# EAGLE design TinkerKit-board (EAGLE 7.5.0)
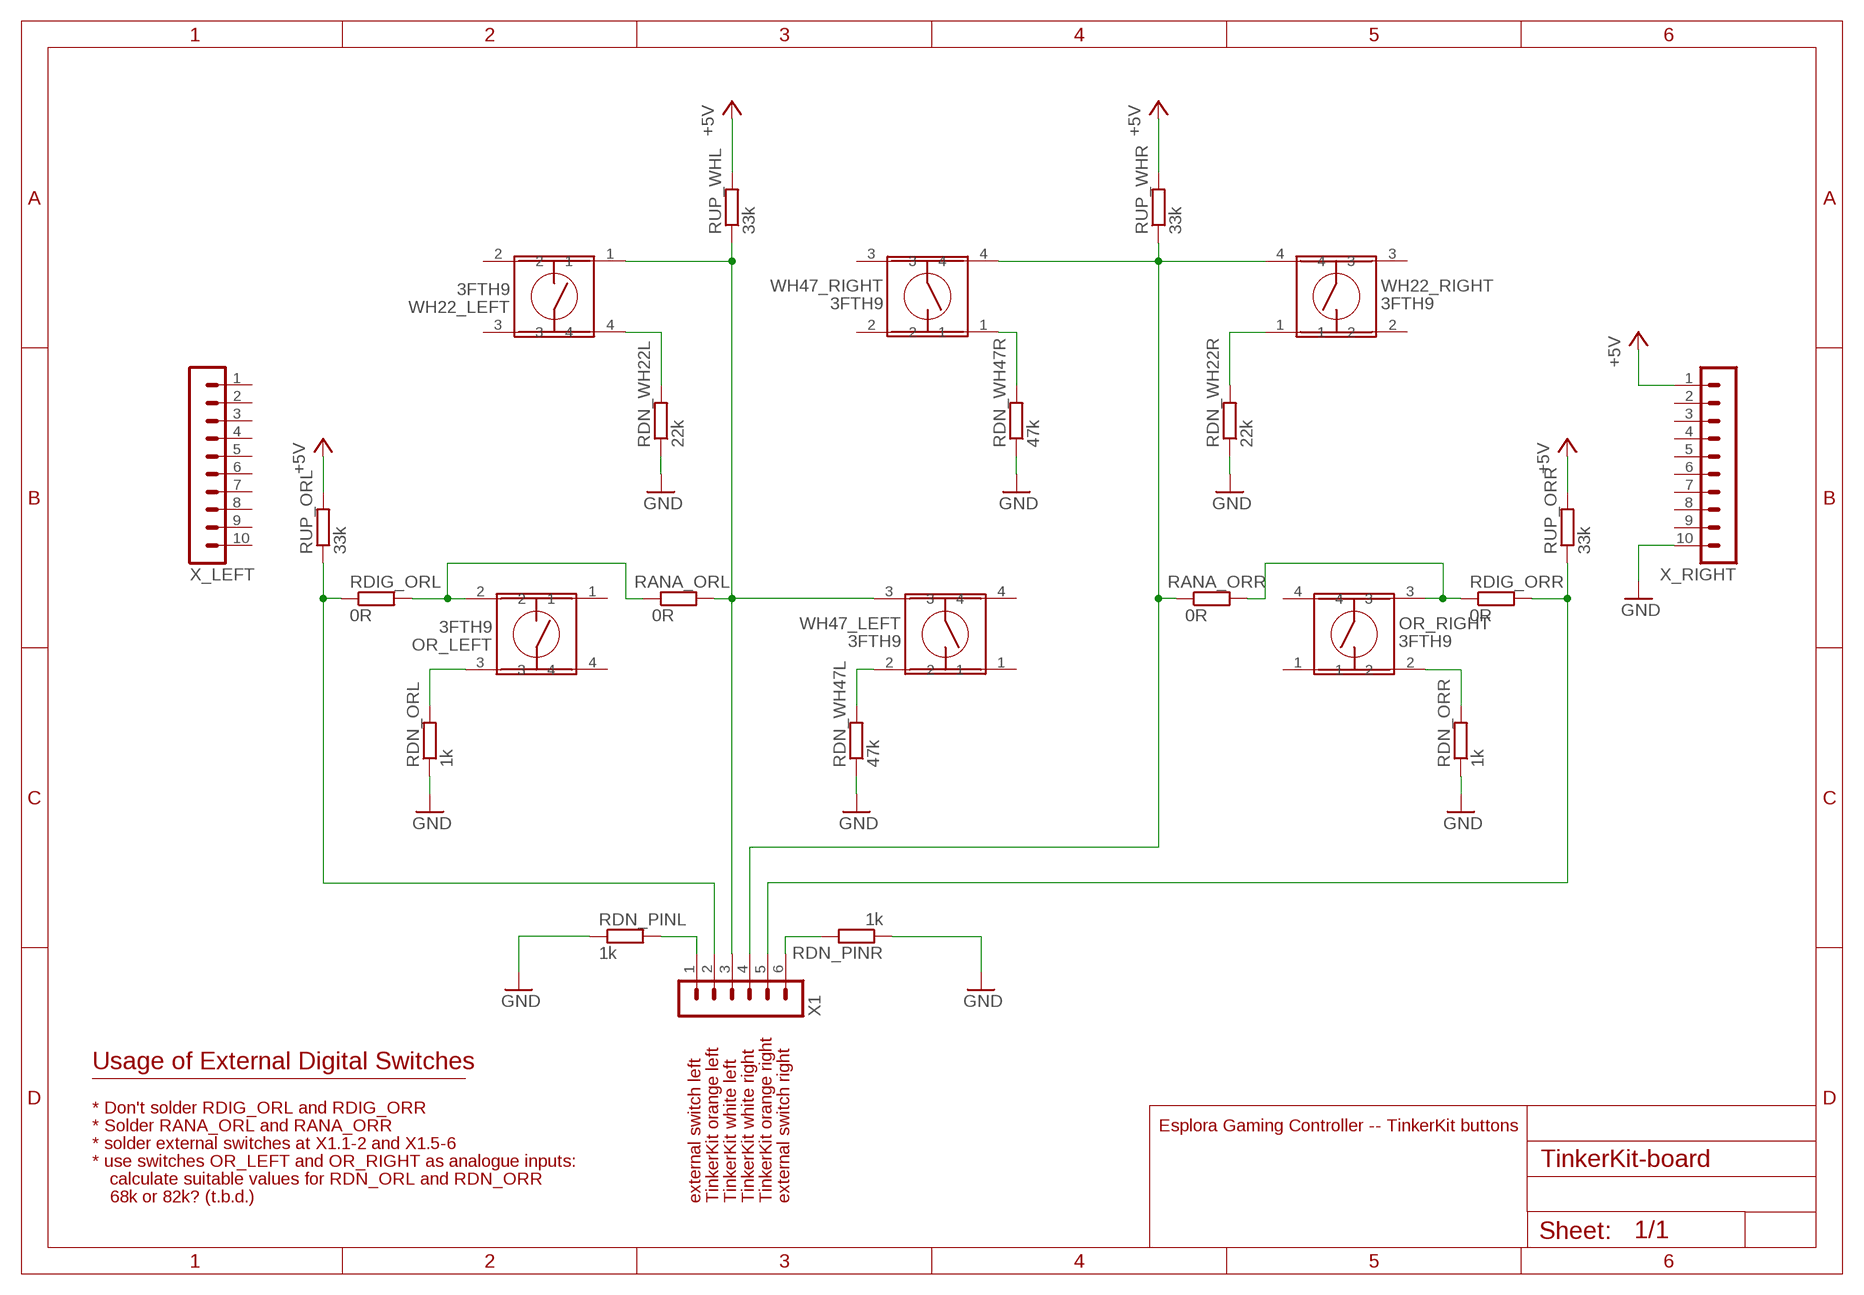
[diagram p0: schematic, sheet 1]

## Parts
OR_LEFT  3FTH9  [3FTH9]
OR_RIGHT  3FTH9  [3FTH9]
RANA_ORL  0R  R-EU_R0603  [R0603]
RANA_ORR  0R  R-EU_R0603  [R0603]
RDIG_ORL  0R  R-EU_R0603  [R0603]
RDIG_ORR  0R  R-EU_R0603  [R0603]
RDN_ORL  1k  R-EU_M1206  [M1206]
RDN_ORR  1k  R-EU_M1206  [M1206]
RDN_PINL  1k  R-EU_R0603  [R0603]
RDN_PINR  1k  R-EU_R0603  [R0603]
RDN_WH22L  22k  R-EU_M1206  [M1206]
RDN_WH22R  22k  R-EU_M1206  [M1206]
RDN_WH47L  47k  R-EU_M1206  [M1206]
RDN_WH47R  47k  R-EU_M1206  [M1206]
RUP_ORL  33k  R-EU_M1206  [M1206]
RUP_ORR  33k  R-EU_M1206  [M1206]
RUP_WHL  33k  R-EU_M1206  [M1206]
RUP_WHR  33k  R-EU_M1206  [M1206]
WH22_LEFT  3FTH9  [3FTH9]
WH22_RIGHT  3FTH9  [3FTH9]
WH47_LEFT  3FTH9  [3FTH9]
WH47_RIGHT  3FTH9  [3FTH9]
X1  MA06-1  [MA06-1]
X_LEFT  MA10-1  [MA10-1]
X_RIGHT  MA10-1  [MA10-1]

## Nets
+5V: RUP_ORL.2 RUP_ORR.2 RUP_WHL.2 RUP_WHR.2 X_RIGHT.1
GND: RDN_ORL.1 RDN_ORR.1 RDN_PINL.1 RDN_PINR.1 RDN_WH22L.1 RDN_WH22R.1 RDN_WH47L.1 RDN_WH47R.1 X_RIGHT.10
N$1: OR_LEFT.3 RDN_ORL.2
N$3: OR_RIGHT.2 RDN_ORR.2
N$6: RDN_WH22L.2 WH22_LEFT.4
N$7: RDN_WH47L.2 WH47_LEFT.2
N$8: RDN_WH22R.2 WH22_RIGHT.1
N$9: RDN_WH47R.2 WH47_RIGHT.1
N$15: OR_LEFT.2 RANA_ORL.1 RDIG_ORL.2
N$16: OR_RIGHT.3 RANA_ORR.2 RDIG_ORR.1
ORANGE_LEFT: RDIG_ORL.1 RUP_ORL.1 X1.2
ORANGE_RIGHT: RDIG_ORR.2 RUP_ORR.1 X1.5
PIN_LEFT: RDN_PINL.2 X1.1
PIN_RIGHT: RDN_PINR.2 X1.6
WHITE_LEFT: RANA_ORL.2 RUP_WHL.1 WH22_LEFT.1 WH47_LEFT.3 X1.3
WHITE_RIGHT: RANA_ORR.1 RUP_WHR.1 WH22_RIGHT.4 WH47_RIGHT.4 X1.4
Unconnected: OR_LEFT.1 OR_LEFT.4 OR_RIGHT.1 OR_RIGHT.4 WH22_LEFT.2 WH22_LEFT.3 WH22_RIGHT.2 WH22_RIGHT.3 WH47_LEFT.1 WH47_LEFT.4 WH47_RIGHT.2 WH47_RIGHT.3 X_LEFT.1 X_LEFT.2 X_LEFT.3 X_LEFT.4 X_LEFT.5 X_LEFT.6 X_LEFT.7 X_LEFT.8 X_LEFT.9 X_LEFT.10 X_RIGHT.2 X_RIGHT.3 X_RIGHT.4 X_RIGHT.5 X_RIGHT.6 X_RIGHT.7 X_RIGHT.8 X_RIGHT.9

## Notes on the sheet
- Usage of External Digital Switches
- * Don't solder RDIG_ORL and RDIG_ORR
- * Solder RANA_ORL and RANA_ORR | Esplora Gaming Controller -- TinkerKit buttons
- * solder external switches at X1.1-2 and X1.5-6
- * use switches OR_LEFT and OR_RIGHT as analogue inputs:
- calculate suitable values for RDN_ORL and RDN_ORR
- 68k or 82k? (t.b.d.) | external switch left | TinkerKit orange left | TinkerKit white left | TinkerKit white right | TinkerKit orange right | external switch right

## Library data of the parts
OR_LEFT OR_RIGHT WH22_LEFT WH22_RIGHT WH47_LEFT WH47_RIGHT = EsploraGamingController:3FTH9: Multimec 3 series switches 3FTH9
RANA_ORL RANA_ORR RDIG_ORL RDIG_ORR RDN_ORL RDN_ORR RDN_PINL RDN_PINR RDN_WH22L RDN_WH22R RDN_WH47L RDN_WH47R RUP_ORL RUP_ORR RUP_WHL RUP_WHR = rcl:R-EU_: RESISTOR, European symbol
X1 = con-lstb:MA06-1: PIN HEADER; OC_FARNELL: unknown; OC_NEWARK: unknown
X_LEFT X_RIGHT = con-lstb:MA10-1: PIN HEADER; OC_FARNELL: unknown; OC_NEWARK: unknown

## Board
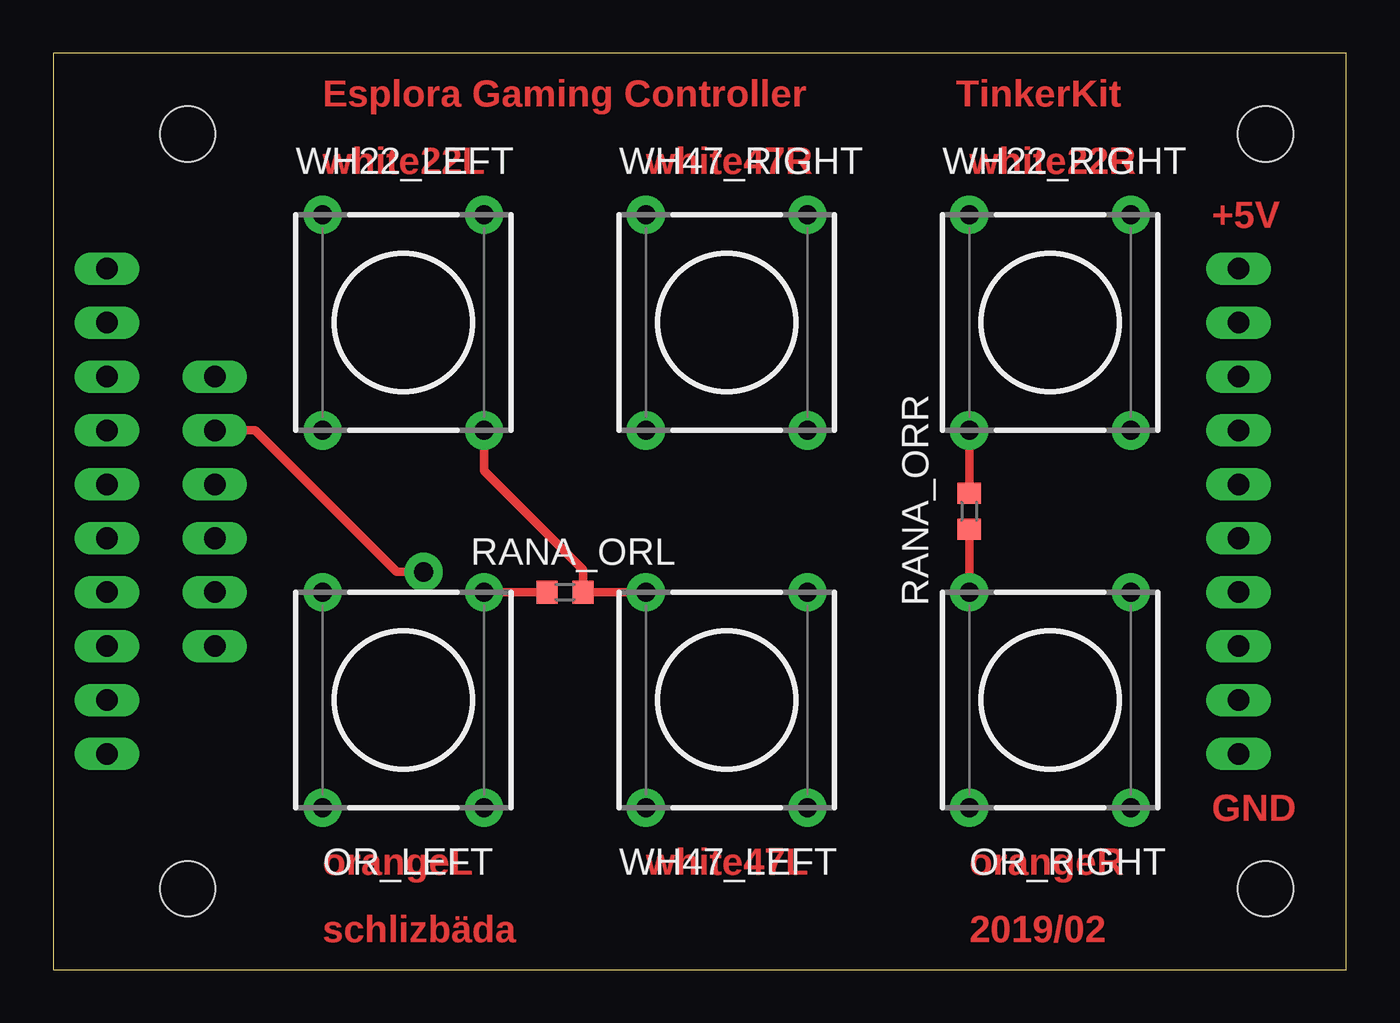
[diagram p1: board, top side]
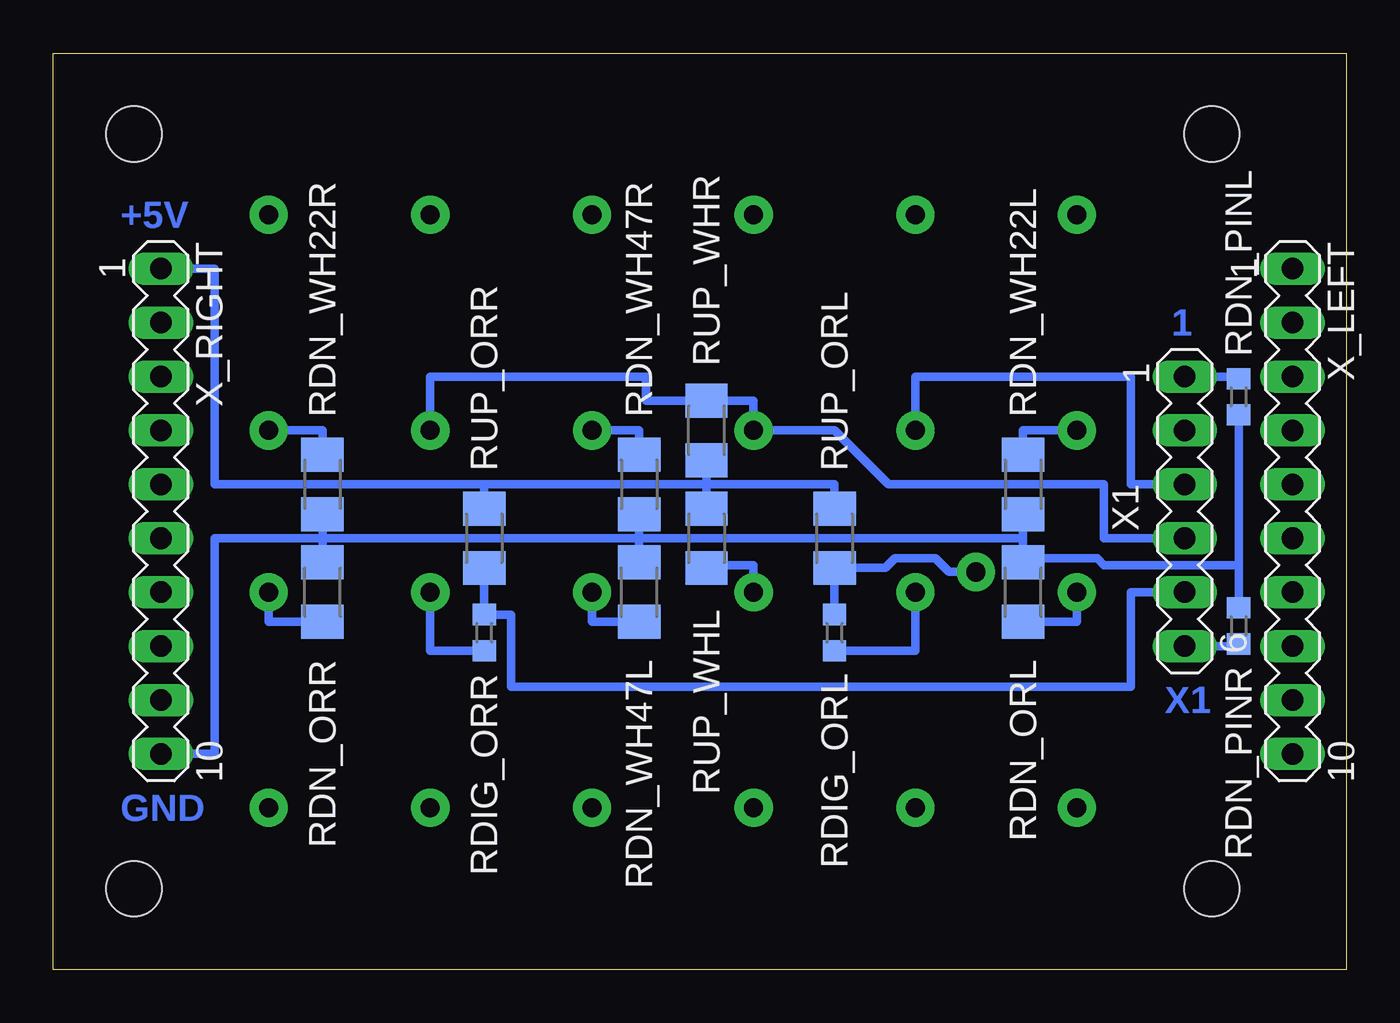
[diagram p2: board, bottom side, seen from below]

Size 60.96 x 43.18 mm. Coordinates in mm from the lower left corner, seen from the top.
Outline: 0,0 60.96,0 60.96,43.18 0,43.18 0,0
Copper layers (1*16): Top 0.035mm / dielectric 1.5mm / Bottom 0.035mm
Design rules "default": minimum track width 10mil, minimum drill 24mil, track to track 8mil, track to pad 8mil, pad to pad 8mil, via to via 8mil, smd to smd 8mil, copper to edge 40mil, drill to drill 8mil, minimum pad ring 10mil, minimum via ring 8mil, stop-mask expansion 4mil, vias tented up to drill 0mil, thermal gap 10mil
Holes 2.6 mm at 6.35,3.81 57.15,3.81 57.15,39.37 6.35,39.37

### Footprints (pad centres in the part's own frame; a part is rotated, then mirrored left to right if it is on the bottom)
3FTH9 = drill 0.9 pad 1.8: 1 -5.08,-2.54; 2 5.08,-2.54; 3 5.08,5.08; 4 -5.08,5.08
R0603 = smd 1 x 1.1: 1 -0.85,0; 2 0.85,0
M1206 = smd 1.6 x 2: 1 -1.4,0; 2 1.4,0
MA06-1 = drill 1.016 long: 1 -6.35,0; 2 -3.81,0; 3 -1.27,0; 4 1.27,0; 5 3.81,0; 6 6.35,0
MA10-1 = drill 1.016 long: 1 -11.43,0; 2 -8.89,0; 3 -6.35,0; 4 -3.81,0; 5 -1.27,0; 6 1.27,0; 7 3.81,0; 8 6.35,0; 9 8.89,0; 10 11.43,0

### Placement (x,y rotation side)
OR_LEFT  17.78,12.7 90 top
OR_RIGHT  48.26,12.7 90 top
RANA_ORL  24.13,17.78 0 top
RANA_ORR  43.18,21.59 270 top
RDIG_ORL  24.13,15.88 270 bottom
RDIG_ORR  40.64,15.88 90 bottom
RDN_ORL  15.24,17.78 270 bottom
RDN_ORR  48.26,17.78 270 bottom
RDN_PINL  5.08,26.99 90 bottom
RDN_PINR  5.08,16.19 270 bottom
RDN_WH22L  15.24,22.86 90 bottom
RDN_WH22R  48.26,22.86 90 bottom
RDN_WH47L  33.34,17.78 270 bottom
RDN_WH47R  33.34,22.86 90 bottom
RUP_ORL  24.13,20.32 90 bottom
RUP_ORR  40.64,20.32 90 bottom
RUP_WHL  30.16,20.32 90 bottom
RUP_WHR  30.16,25.4 270 bottom
U$2  [A5L-LOC]  -60.96,-55.88 0 top  (outside the outline)
WH22_LEFT  17.78,30.48 90 top
WH22_RIGHT  48.26,30.48 90 top
WH47_LEFT  33.02,12.7 90 top
WH47_RIGHT  33.02,30.48 90 top
X1  7.62,21.59 270 bottom
X_LEFT  2.54,21.59 270 bottom
X_RIGHT  55.88,21.59 270 bottom

### Tracks (layer width: path | path; a pad name or v marks a point on that pad's centre or on a via)
+5V
  Bottom 0.406: X_RIGHT.1 53.34,33.02 53.34,22.86 40.64,22.86 | 40.64,22.86 30.16,22.86 | 30.16,22.86 24.13,22.86 RUP_ORL.2 | RUP_WHL.2 30.16,22.86 | RUP_ORR.2 40.64,22.86 | RUP_WHR.2 30.16,22.86
GND
  Bottom 0.406: X_RIGHT.10 53.34,10.16 53.34,20.32 48.26,20.32 | 48.26,20.32 33.34,20.32 | 33.34,20.32 15.24,20.32 | RDN_WH22R.1 48.26,20.32 | RDN_ORR.1 48.26,20.32 | RDN_WH47R.1 33.34,20.32 | 33.34,20.32 RDN_WH47L.1 | RDN_WH22L.1 15.24,20.32 | 15.24,20.32 RDN_ORL.1 | RDN_PINL.1 5.08,19.05 | 15.11,19.05 RDN_ORL.1 | RDN_PINR.1 5.08,19.05 | 5.08,19.05 11.43,19.05 11.75,19.37 15.05,19.37 RDN_ORL.1
N$1
  Bottom 0.406: RDN_ORL.2 12.7,16.38 OR_LEFT.3
N$3
  Bottom 0.406: RDN_ORR.2 50.8,16.38 OR_RIGHT.2
N$6
  Bottom 0.406: RDN_WH22L.2 15.24,25.4 WH22_LEFT.4
N$7
  Bottom 0.406: WH47_LEFT.2 35.56,16.38 RDN_WH47L.2
N$8
  Bottom 0.406: RDN_WH22R.2 48.26,25.4 WH22_RIGHT.1
N$9
  Bottom 0.406: RDN_WH47R.2 33.34,25.4 WH47_RIGHT.1
N$15
  Top 0.406: RANA_ORL.1 OR_LEFT.2
  Bottom 0.406: RDIG_ORL.2 20.32,15.03 OR_LEFT.2
N$16
  Top 0.406: RANA_ORR.2 OR_RIGHT.3
  Bottom 0.406: RDIG_ORR.1 43.18,15.03 OR_RIGHT.3
ORANGE_LEFT  (via drill 0.9 pad 1.8)
  Top 0.406: X1.2 9.53,25.4 16.19,18.73 v17.46,18.73
  Bottom 0.406: RDIG_ORL.1 RUP_ORL.1 21.72,18.92 21.27,19.37 19.37,19.37 18.73,18.73 v17.46,18.73
ORANGE_RIGHT
  Bottom 0.406: X1.5 10.16,17.78 10.16,13.34 39.37,13.34 39.37,16.73 RDIG_ORR.2 RUP_ORR.1 40.64,19.05
PIN_LEFT
  Bottom 0.406: RDN_PINL.2 5.08,27.94 X1.1
PIN_RIGHT
  Bottom 0.406: RDN_PINR.2 5.08,15.24 X1.6
WHITE_LEFT
  Top 0.406: WH47_LEFT.3 RANA_ORL.2 24.98,18.84 20.32,23.5 WH22_LEFT.1
  Bottom 0.406: RUP_WHL.1 30.16,19.05 27.94,19.05 WH47_LEFT.3 | X1.3 10.16,22.86 10.16,27.94 20.32,27.94 WH22_LEFT.1
WHITE_RIGHT
  Top 0.406: RANA_ORR.1 WH22_RIGHT.4
  Bottom 0.406: WH22_RIGHT.4 43.18,27.94 33.02,27.94 33.02,26.8 RUP_WHR.1 27.94,26.8 WH47_RIGHT.4 24.13,25.4 21.59,22.86 11.43,22.86 11.43,20.32 X1.4

### Text on the board
Top: Esplora Gaming Controller | TinkerKit | white22L | white47R | white22R | +5V | GND | orangeL | white47L | orangeR | schlizbäda | 2019/02
Bottom: +5V | 1 | X1 | GND
Measures: 43,18 | 39,37 | 30,48 | 12,70 | 3,81 | diameter: | 6,35 | 2,6mm (4x) | 16,51 | 31,75 | 46,99 | 57,15 | 60,96
Document: Esplora Gaming Controller -- TinkerKit buttons